# EAGLE board SzineszFeny_V11 (EAGLE 7.4.0), part 1 of 2
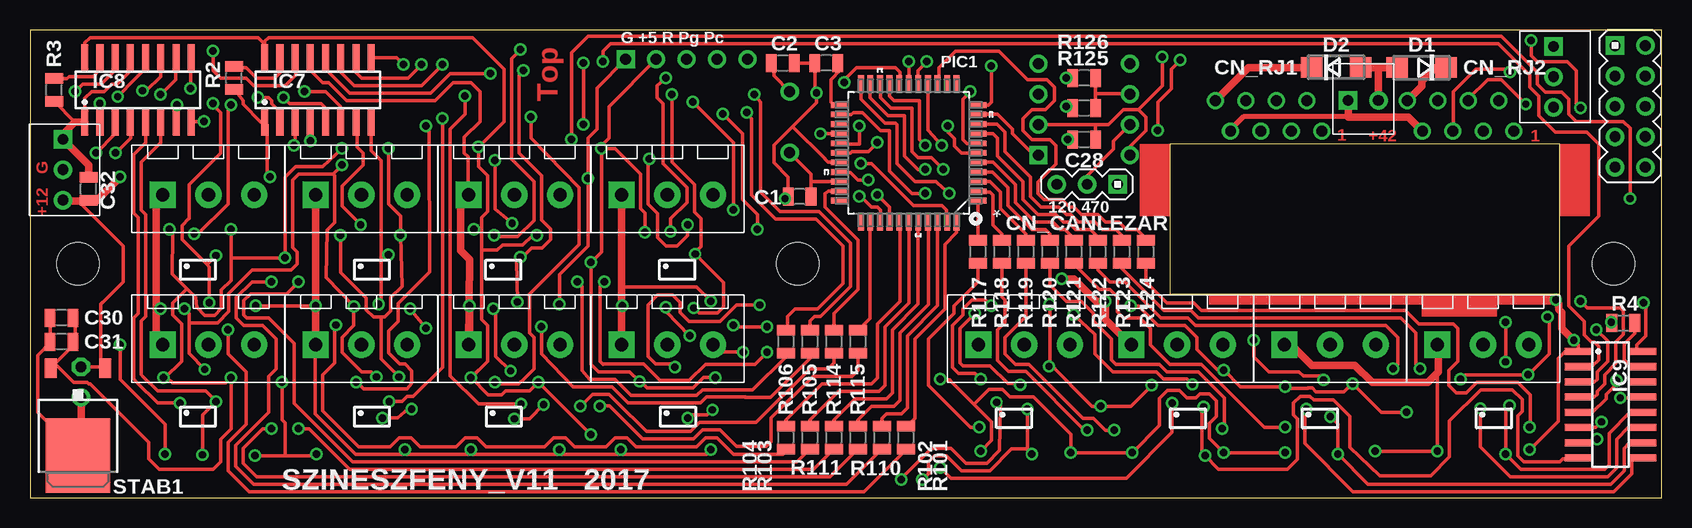
[diagram p2: board, top side]
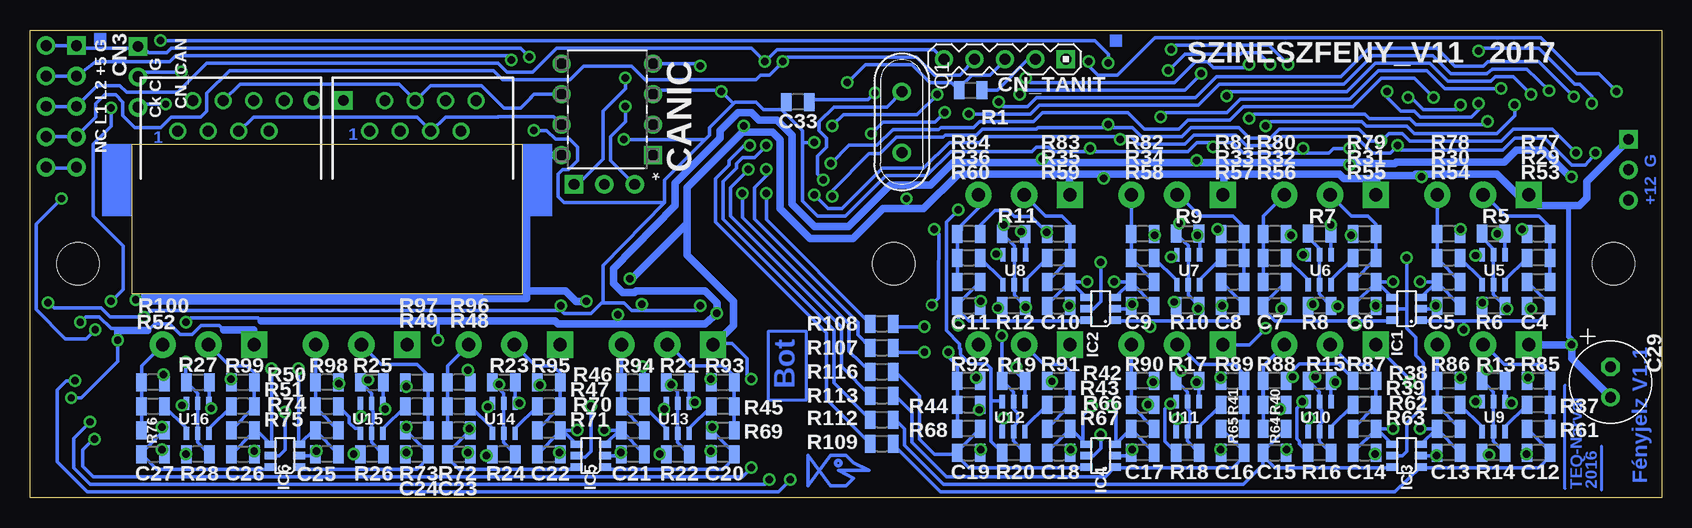
[diagram p3: board, bottom side, seen from below]

Size 136 x 39 mm. Coordinates in mm from the lower left corner, seen from the top.
Outline: 0,0 136,0 136,39 0,39 0,0
Outline: 127.5,29.5 95,29.5 95,17 127.5,17 127.5,29.5
Copper layers (1*16): Top 0.035mm / dielectric 1.5mm / Bottom 0.035mm
Design rules "default": minimum track width 10mil, minimum drill 24mil, track to track 12mil, track to pad 12mil, pad to pad 12mil, via to via 12mil, smd to smd 0mil, copper to edge 12mil, drill to drill 8mil, minimum pad ring 10mil, minimum via ring 8mil, stop-mask expansion 4mil, vias tented up to drill 0mil, thermal gap 10mil
Net classes: 0 default: width 0.305 mm, clearance 0.305 mm; 1 Tap: width 0.406 mm, clearance 0.305 mm
Holes 3.5 mm at 64,19.5 4,19.5 132,19.5
tRestrict: area 60.5,16 to 67.5,23; area 0.5,16 to 7.5,23; area 128.5,16 to 135.5,23
bRestrict: area 60.5,16 to 67.5,23; area 0.5,16 to 7.5,23; area 128.5,16 to 135.5,23

## Footprints (pad centres in the part's own frame; a part is rotated, then mirrored left to right if it is on the bottom)
R0805 = smd 0.9 x 1.5: 1 -0.953,0; 2 0.953,0
C_EL1RASZT07 = drill 0.914 pad 1.524 octagon: P+ 1.27,0 | drill 0.914 pad 1.524: P- -1.27,0
DIP254P762X432-8 = drill 0.914 pad 1.524 square: 1 -3.81,3.81 | drill 0.914 pad 1.524: 2 -3.81,1.27; 3 -3.81,-1.27; 4 -3.81,-3.81; 5 3.81,-3.81; 6 3.81,-1.27; 7 3.81,1.27; 8 3.81,3.81
PIN05_2 = drill 0.914 pad 1.524 square: 1 -5.08,0 | drill 0.914 pad 1.524: 2 -5.08,2.54; 3 -2.54,0; 4 -2.54,2.54; 5 0,0; 6 0,2.54; 7 2.54,0; 8 2.54,2.54; 9 5.08,0; 10 5.08,2.54
PIN03_1 = drill 0.914 pad 1.524 square: 1 -2.54,0 | drill 0.914 pad 1.524: 2 0,0; 3 2.54,0
RJ45_CSAKPIN = drill 0.9 pad 1.4: 1 -4.445,3.81; 2 -3.175,6.35; 3 -1.905,3.81; 4 -0.635,6.35; 5 0.635,3.81; 6 1.905,6.35; 7 3.175,3.81; 8 4.445,6.35
PIN05_1 = drill 0.914 pad 1.524 square: 1 -5.08,0 | drill 0.914 pad 1.524: 2 -2.54,0; 3 0,0; 4 2.54,0; 5 5.08,0
DO214AC = smd 1.8 x 1.7: A 2.05,0; C -2.05,0
TSOP-6 = smd 0.6 x 1: 1 -0.95,-1.2; 2 0,-1.2; 3 0.95,-1.2; 4 0.95,1.2; 5 0,1.2; 6 -0.95,1.2
SO16 = smd 0.6 x 2.2: 1 -4.445,-2.695; 2 -3.175,-2.695; 3 -1.905,-2.695; 4 -0.635,-2.695; 5 0.635,-2.695; 6 1.905,-2.695; 7 3.175,-2.695; 8 4.445,-2.695; 9 4.445,2.695; 10 3.175,2.695; 11 1.905,2.695; 12 0.635,2.695; 13 -0.635,2.695; 14 -1.905,2.695; 15 -3.175,2.695; 16 -4.445,2.695
QFP80P1200X1200X120-44N = smd 1.473 x 0.483: 1 -5.74,3.988; 2 -5.74,3.2; 3 -5.74,2.388; 4 -5.74,1.6; 5 -5.74,0.787; 6 -5.74,0; 7 -5.74,-0.787; 8 -5.74,-1.6; 9 -5.74,-2.388; 10 -5.74,-3.2; 11 -5.74,-3.988; 23 5.74,-3.988; 24 5.74,-3.2; 25 5.74,-2.388; 26 5.74,-1.6; 27 5.74,-0.787; 28 5.74,0; 29 5.74,0.787; 30 5.74,1.6; 31 5.74,2.388; 32 5.74,3.2; 33 5.74,3.988 | smd 0.483 x 1.473: 12 -3.988,-5.74; 13 -3.2,-5.74; 14 -2.388,-5.74; 15 -1.6,-5.74; 16 -0.787,-5.74; 17 0,-5.74; 18 0.787,-5.74; 19 1.6,-5.74; 20 2.388,-5.74; 21 3.2,-5.74; 22 3.988,-5.74; 34 3.988,5.74; 35 3.2,5.74; 36 2.388,5.74; 37 1.6,5.74; 38 0.787,5.74; 39 0,5.74; 40 -0.787,5.74; 41 -1.6,5.74; 42 -2.388,5.74; 43 -3.2,5.74; 44 -3.988,5.74
XTAL_QS = drill 0.914 pad 1.524: 1 -2.54,0; 2 2.54,0
R0805@1 = smd 0.9 x 1.5: 1 -0.953,0; 2 0.953,0
TO252 = smd 1 x 1.6: 1 -2.28,-4.8; 2 2.28,-4.8 | smd 5.4 x 6.2: 3 0,2.5
SOT26 = smd 0.45 x 1.1: P$1 -0.95,-1.25; P$2 0,-1.25; P$3 0.95,-1.25; P$4 0.95,1.25; P$5 0,1.25; P$6 -0.95,1.25
FEHER_TUS_3 = drill 0.914 pad 1.524 square: P$1 0,0 | drill 0.914 pad 1.524: P$2 2.54,0; P$3 5.08,0
FEHER_TUS_2 = drill 0.914 pad 1.524 square: P$1 0,0 | drill 0.914 pad 1.524: P$2 2.54,0
ZOLD_KICSI_3P = drill 1.1 pad 2.184 square: 1 -3.81,-0.5 | drill 1.1 pad 2.184: 2 0,-0.5; 3 3.81,-0.5

## Placement (x,y rotation side)
C1  22  [R0805]  64.16,25.09 180 top
C2  22  [R0805]  62.75,36.25 0 top
C3  10u  [R0805]  66.38,36.25 180 top
C4  100n  [R0805]  10.25,16 180 bottom
C5  100n  [R0805]  17.75,16 180 bottom
C6  100n  [R0805]  24.75,16 0 bottom
C7  100n  [R0805]  32.25,16 0 bottom
C8  100n  [R0805]  35.75,16 180 bottom
C9  100n  [R0805]  43.25,16 180 bottom
C10  100n  [R0805]  50.25,16 0 bottom
C11  100n  [R0805]  57.75,16 0 bottom
C12  100n  [R0805]  10.25,3.75 180 bottom
C13  100n  [R0805]  17.75,3.75 180 bottom
C14  100n  [R0805]  24.75,3.75 0 bottom
C15  100n  [R0805]  32.25,3.75 0 bottom
C16  100n  [R0805]  35.75,3.75 180 bottom
C17  100n  [R0805]  43.25,3.75 180 bottom
C18  100n  [R0805]  50.25,3.75 0 bottom
C19  100n  [R0805]  57.75,3.75 0 bottom
C20  100n  [R0805]  78.25,3.62 180 bottom
C21  100n  [R0805]  85.75,3.62 180 bottom
C22  100n  [R0805]  92.75,3.62 0 bottom
C23  100n  [R0805]  100.25,3.62 0 bottom
C24  100n  [R0805]  103.75,3.62 180 bottom
C25  100n  [R0805]  111.25,3.62 180 bottom
C26  100n  [R0805]  118.25,3.62 0 bottom
C27  100n  [R0805]  125.75,3.62 0 bottom
C28  100n  [R0805]  87.88,29.88 0 top
C29  100u  [C_EL1RASZT07]  4.25,9.62 90 bottom
C30  10u  [R0805]  2.62,13 180 top
C31  100n  [R0805]  2.62,15 180 top
C32  100n  [R0805]  4.88,25.75 90 top
C33  100n  [R0805]  72,33 180 bottom
CANIC  MCP2551  [DIP254P762X432-8]  87.88,32.38 180 bottom
CN3  PIN05_2'THT'  [PIN05_2]  132.12,32.62 270 top
CN_CANLEZAR  PIN03_1  [PIN03_1]  88.12,26.12 180 top
CN_RJ1  RJ45_CSAKPIN  [RJ45_CSAKPIN]  103.25,26.75 0 bottom
CN_RJ2  RJ45_CSAKPIN  [RJ45_CSAKPIN]  119.25,26.75 0 bottom
CN_TANIT  PIN05_1  [PIN05_1]  54.73,36.56 180 bottom
D1  SS16  [DO214AC]  116,35.88 180 top
D2  SS16  [DO214AC]  108.88,35.88 0 top
IC1  BEM_VEDO  [TSOP-6]  21.25,15.75 90 bottom
IC2  BEM_VEDO  [TSOP-6]  46.75,15.75 90 bottom
IC3  BEM_VEDO  [TSOP-6]  21.25,3.5 90 bottom
IC4  BEM_VEDO  [TSOP-6]  46.75,3.5 90 bottom
IC5  BEM_VEDO  [TSOP-6]  89.25,3.5 90 bottom
IC6  BEM_VEDO  [TSOP-6]  114.75,3.5 90 bottom
IC7  SCT2168SOP16  [SO16]  24,34 0 top
IC8  SCT2168SOP16  [SO16]  9,34 0 top
IC9  SCT2168SOP16  [SO16]  131.75,7.75 270 top
PIC1  PIC18F45K80-I/PT  [QFP80P1200X1200X120-44N]  73.25,28.75 180 top
Q1  [XTAL_QS]  63.32,31.32 270 bottom
R1  2.2k  [R0805@1]  57.59,33.97 0 bottom
R2  470  [R0805@1]  17,35 90 top
R3  470  [R0805@1]  2,34 90 top
R4  470  [R0805@1]  132.81,14.56 0 top
R5  10k  [R0805@1]  14,22.01 0 bottom
R6  10k  [R0805@1]  14,16 180 bottom
R7  10k  [R0805@1]  28.51,22.01 0 bottom
R8  10k  [R0805@1]  28.5,16 180 bottom
R9  10k  [R0805@1]  39.51,22.01 0 bottom
R10  10k  [R0805@1]  39.5,16 180 bottom
R11  10k  [R0805@1]  54,22 0 bottom
R12  10k  [R0805@1]  54,16 180 bottom
R13  10k  [R0805@1]  14,9.75 0 bottom
R14  10k  [R0805@1]  14,3.75 180 bottom
R15  10k  [R0805@1]  28.5,9.75 0 bottom
R16  10k  [R0805@1]  28.5,3.75 180 bottom
R17  10k  [R0805@1]  39.5,9.75 0 bottom
R18  10k  [R0805@1]  39.5,3.75 180 bottom
R19  10k  [R0805@1]  54,9.75 0 bottom
R20  10k  [R0805@1]  54,3.75 180 bottom
R21  10k  [R0805@1]  82,9.62 0 bottom
R22  10k  [R0805@1]  82,3.62 180 bottom
R23  10k  [R0805@1]  96.5,9.62 0 bottom
R24  10k  [R0805@1]  96.5,3.62 180 bottom
R25  10k  [R0805@1]  107.5,9.62 0 bottom
R26  10k  [R0805@1]  107.5,3.62 180 bottom
R27  10k  [R0805@1]  122,9.62 0 bottom
R28  10k  [R0805@1]  122,3.62 180 bottom
R29  22  [R0805@1]  10.25,20 180 bottom
R30  22  [R0805@1]  17.75,20 0 bottom
R31  22  [R0805@1]  24.75,20 180 bottom
R32  22  [R0805@1]  32.25,20 0 bottom
R33  22  [R0805@1]  35.75,20 180 bottom
R34  22  [R0805@1]  43.25,20 0 bottom
R35  22  [R0805@1]  50.25,20 180 bottom
R36  22  [R0805@1]  57.75,20 0 bottom
R37  22  [R0805@1]  10.25,7.75 180 bottom
R38  22  [R0805@1]  17.75,7.75 0 bottom
R39  22  [R0805@1]  24.75,7.75 180 bottom
R40  22  [R0805@1]  32.25,7.75 0 bottom
R41  22  [R0805@1]  35.75,7.75 180 bottom
R42  22  [R0805@1]  43.25,7.75 0 bottom
R43  22  [R0805@1]  50.25,7.75 180 bottom
R44  22  [R0805@1]  57.75,7.75 0 bottom
R45  22  [R0805@1]  78.25,7.62 180 bottom
R46  22  [R0805@1]  85.75,7.62 0 bottom
R47  22  [R0805@1]  92.75,7.62 180 bottom
R48  22  [R0805@1]  100.25,7.62 0 bottom
R49  22  [R0805@1]  103.75,7.62 180 bottom
R50  22  [R0805@1]  111.25,7.62 0 bottom
R51  22  [R0805@1]  118.25,7.62 180 bottom
R52  22  [R0805@1]  125.75,7.62 0 bottom
R53  10k  [R0805@1]  10.25,18 0 bottom
R54  10k  [R0805@1]  17.75,18 0 bottom
R55  10k  [R0805@1]  24.75,18 180 bottom
R56  10k  [R0805@1]  32.25,18 180 bottom
R57  10k  [R0805@1]  35.75,18 0 bottom
R58  10k  [R0805@1]  43.25,18 0 bottom
R59  10k  [R0805@1]  50.25,18 180 bottom
R60  10k  [R0805@1]  57.75,18 180 bottom
R61  10k  [R0805@1]  10.25,5.75 0 bottom
R62  10k  [R0805@1]  17.75,5.75 0 bottom
R63  10k  [R0805@1]  24.75,5.75 180 bottom
R64  10k  [R0805@1]  32.25,5.75 180 bottom
R65  10k  [R0805@1]  35.75,5.75 0 bottom
R66  10k  [R0805@1]  43.25,5.75 0 bottom
R67  10k  [R0805@1]  50.25,5.75 180 bottom
R68  10k  [R0805@1]  57.75,5.75 180 bottom
R69  10k  [R0805@1]  78.25,5.62 0 bottom
R70  10k  [R0805@1]  85.75,5.62 0 bottom
R71  10k  [R0805@1]  92.75,5.62 180 bottom
R72  10k  [R0805@1]  100.25,5.62 180 bottom
R73  10k  [R0805@1]  103.75,5.62 0 bottom
R74  10k  [R0805@1]  111.25,5.62 0 bottom
R75  10k  [R0805@1]  118.25,5.62 180 bottom
R76  10k  [R0805@1]  125.75,5.62 180 bottom
R77  10k  [R0805@1]  10.25,22 0 bottom
R78  10k  [R0805@1]  17.75,22 180 bottom
R79  10k  [R0805@1]  24.75,22 0 bottom
R80  10k  [R0805@1]  32.25,22 180 bottom
R81  10jk  [R0805@1]  35.75,22 0 bottom
R82  10k  [R0805@1]  43.25,22 180 bottom
R83  10k  [R0805@1]  50.25,22 0 bottom
R84  10k  [R0805@1]  57.75,22 180 bottom
R85  10k  [R0805@1]  10.25,9.75 0 bottom
R86  10k  [R0805@1]  17.75,9.75 180 bottom
R87  10k  [R0805@1]  24.75,9.75 0 bottom
R88  10k  [R0805@1]  32.25,9.75 180 bottom
R89  10k  [R0805@1]  35.75,9.75 0 bottom
R90  10k  [R0805@1]  43.25,9.75 180 bottom
R91  10k  [R0805@1]  50.25,9.75 0 bottom
R92  10k  [R0805@1]  57.75,9.75 180 bottom
R93  10k  [R0805@1]  78.25,9.62 0 bottom
R94  10k  [R0805@1]  85.75,9.62 180 bottom
R95  10k  [R0805@1]  92.75,9.62 0 bottom
R96  10k  [R0805@1]  100.25,9.62 180 bottom
R97  10k  [R0805@1]  103.75,9.62 0 bottom
R98  10k  [R0805@1]  111.25,9.62 180 bottom
R99  10k  [R0805@1]  118.25,9.62 0 bottom
R100  10k  [R0805@1]  125.75,9.62 180 bottom
R101  10k  [R0805@1]  73,5 270 top
R102  10k  [R0805@1]  71,5 270 top
R103  10k  [R0805@1]  65,5 270 top
R104  10k  [R0805@1]  63,5 270 top
R105  10k  [R0805@1]  65,13 270 top
R106  10k  [R0805@1]  63,13 270 top
R107  10k  [R0805@1]  65,12.5 0 bottom
R108  10k  [R0805@1]  65,14.5 0 bottom
R109  10k  [R0805@1]  65,4.5 0 bottom
R110  10k  [R0805@1]  69,5 270 top
R111  10k  [R0805@1]  67,5 270 top
R112  10k  [R0805@1]  65,6.5 0 bottom
R113  10k  [R0805@1]  65,8.5 0 bottom
R114  10k  [R0805@1]  67,13 270 top
R115  10k  [R0805@1]  69,13 270 top
R116  10k  [R0805@1]  65,10.5 0 bottom
R117  10k  [R0805@1]  79,20.5 270 top
R118  10k  [R0805@1]  81,20.5 270 top
R119  10k  [R0805@1]  83,20.5 270 top
R120  10k  [R0805@1]  85,20.5 270 top
R121  10k  [R0805@1]  87,20.5 270 top
R122  10k  [R0805@1]  89,20.5 270 top
R123  10k  [R0805@1]  91,20.5 270 top
R124  10k  [R0805@1]  93,20.5 270 top
R125  470  [R0805@1]  87.88,35 180 top
R126  120  [R0805@1]  87.88,32.5 0 top
STAB1  7805DT  [TO252]  4,6 180 top
U5  FDC6306P  [SOT26]  14,19 180 bottom
U6  AP2625GY-HF-3SOT26  [SOT26]  28.51,19 180 bottom
U7  AP2625GY-HF-3SOT26  [SOT26]  39.45,19 180 bottom
U8  AP2625GY-HF-3SOT26  [SOT26]  53.95,18.99 180 bottom
U9  AP2625GY-HF-3SOT26  [SOT26]  14,6.75 180 bottom
U10  AP2625GY-HF-3SOT26  [SOT26]  28.51,6.75 180 bottom
U11  AP2625GY-HF-3SOT26  [SOT26]  39.51,6.75 180 bottom
U12  AP2625GY-HF-3SOT26  [SOT26]  54.01,6.74 180 bottom
U13  AP2625GY-HF-3SOT26  [SOT26]  82.01,6.61 180 bottom
U14  AP2625GY-HF-3SOT26  [SOT26]  96.52,6.61 180 bottom
U15  AP2625GY-HF-3SOT26  [SOT26]  107.52,6.61 180 bottom
U16  FDC6306P  [SOT26]  122.02,6.61 180 bottom
U$1  FEHER_TUS_3  [FEHER_TUS_3]  127,37.62 270 top
U$20  FEHER_TUS_3  [FEHER_TUS_3]  2.75,29.88 270 top
U$21  FEHER_TUS_2ALLO  [FEHER_TUS_2]  109.88,33.12 0 top
ZOLD_3P1  ZOLD_KICSI_3P  [ZOLD_KICSI_3P]  14.88,25.75 0 top
ZOLD_3P2  ZOLD_KICSI_3P  [ZOLD_KICSI_3P]  27.62,25.75 0 top
ZOLD_3P3  ZOLD_KICSI_3P  [ZOLD_KICSI_3P]  40.38,25.75 0 top
ZOLD_3P4  ZOLD_KICSI_3P  [ZOLD_KICSI_3P]  53.12,25.75 0 top
ZOLD_3P5  ZOLD_KICSI_3P  [ZOLD_KICSI_3P]  14.88,13.25 0 top
ZOLD_3P6  ZOLD_KICSI_3P  [ZOLD_KICSI_3P]  27.62,13.25 0 top
ZOLD_3P7  ZOLD_KICSI_3P  [ZOLD_KICSI_3P]  40.38,13.25 0 top
ZOLD_3P8  ZOLD_KICSI_3P  [ZOLD_KICSI_3P]  53.12,13.25 0 top
ZOLD_3P9  ZOLD_KICSI_3P  [ZOLD_KICSI_3P]  82.88,13.25 0 top
ZOLD_3P10  ZOLD_KICSI_3P  [ZOLD_KICSI_3P]  95.62,13.25 0 top
ZOLD_3P11  ZOLD_KICSI_3P  [ZOLD_KICSI_3P]  108.38,13.25 0 top
ZOLD_3P12  ZOLD_KICSI_3P  [ZOLD_KICSI_3P]  121.12,13.25 0 top